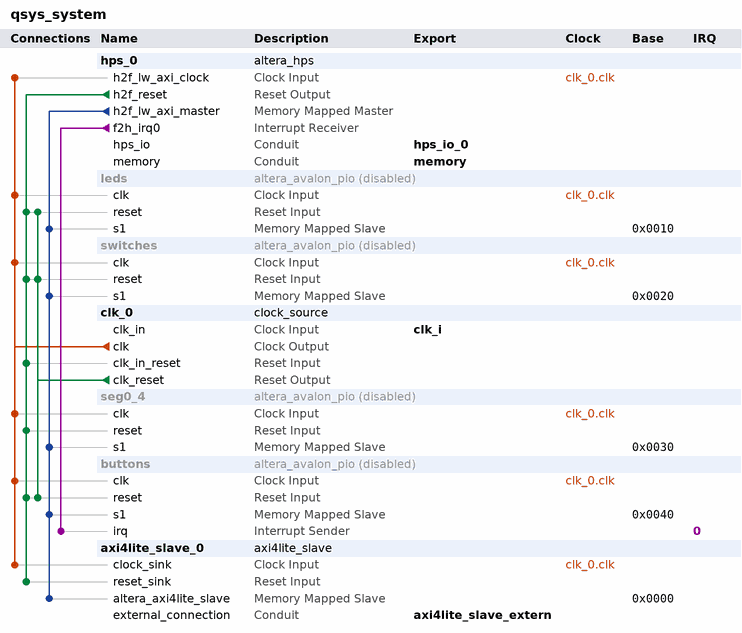
[diagram p0: system contents]
# Platform Designer (Qsys) system qsys_system, Cyclone V 5CSEMA5F31C6
# Parameters at their usual value, and those the tool derives, are not listed.
package require -exact qsys 23.1
create_system qsys_system
set_project_property DEVICE_FAMILY {Cyclone V}
set_project_property DEVICE 5CSEMA5F31C6

add_instance hps_0 altera_hps 23.1
set_instance_parameter_value hps_0 EMAC1_Mode N/A
set_instance_parameter_value hps_0 EMAC1_PinMuxing Unused
set_instance_parameter_value hps_0 F2SCLK_COLDRST_Enable false
set_instance_parameter_value hps_0 F2SCLK_DBGRST_Enable false
set_instance_parameter_value hps_0 F2SCLK_WARMRST_Enable false
set_instance_parameter_value hps_0 F2SINTERRUPT_Enable true
set_instance_parameter_value hps_0 F2S_Width 0
set_instance_parameter_value hps_0 FPGA_PERIPHERAL_OUTPUT_CLOCK_FREQ_EMAC0_GTX_CLK 125
set_instance_parameter_value hps_0 FPGA_PERIPHERAL_OUTPUT_CLOCK_FREQ_EMAC0_MD_CLK 2.5
set_instance_parameter_value hps_0 FPGA_PERIPHERAL_OUTPUT_CLOCK_FREQ_EMAC1_GTX_CLK 125
set_instance_parameter_value hps_0 FPGA_PERIPHERAL_OUTPUT_CLOCK_FREQ_EMAC1_MD_CLK 2.5
set_instance_parameter_value hps_0 HPS_PROTOCOL DDR3
set_instance_parameter_value hps_0 I2C0_Mode N/A
set_instance_parameter_value hps_0 I2C0_PinMuxing Unused
set_instance_parameter_value hps_0 I2C1_Mode N/A
set_instance_parameter_value hps_0 I2C1_PinMuxing Unused
set_instance_parameter_value hps_0 LWH2F_Enable true
set_instance_parameter_value hps_0 MEM_BANKADDR_WIDTH 3
set_instance_parameter_value hps_0 MEM_CLK_FREQ 400.0
set_instance_parameter_value hps_0 MEM_CLK_FREQ_MAX 400.0
set_instance_parameter_value hps_0 MEM_COL_ADDR_WIDTH 10
set_instance_parameter_value hps_0 MEM_DQ_WIDTH 32
set_instance_parameter_value hps_0 MEM_DRV_STR RZQ/7
set_instance_parameter_value hps_0 MEM_ROW_ADDR_WIDTH 15
set_instance_parameter_value hps_0 MEM_RTT_NOM RZQ/4
set_instance_parameter_value hps_0 MEM_RTT_WR RZQ/4
set_instance_parameter_value hps_0 MEM_TCL 11
set_instance_parameter_value hps_0 MEM_TFAW_NS 30.0
set_instance_parameter_value hps_0 MEM_TRAS_NS 35.0
set_instance_parameter_value hps_0 MEM_TRCD_NS 13.75
set_instance_parameter_value hps_0 MEM_TRFC_NS 260.0
set_instance_parameter_value hps_0 MEM_TRP_NS 13.75
set_instance_parameter_value hps_0 MEM_VENDOR JEDEC
set_instance_parameter_value hps_0 MEM_WTCL 8
set_instance_parameter_value hps_0 QSPI_Mode N/A
set_instance_parameter_value hps_0 QSPI_PinMuxing Unused
set_instance_parameter_value hps_0 REF_CLK_FREQ 25.0
set_instance_parameter_value hps_0 S2FCLK_USER2CLK 5
set_instance_parameter_value hps_0 S2F_Width 0
set_instance_parameter_value hps_0 SDIO_Mode N/A
set_instance_parameter_value hps_0 SDIO_PinMuxing Unused
set_instance_parameter_value hps_0 SPIM1_Mode N/A
set_instance_parameter_value hps_0 SPIM1_PinMuxing Unused
set_instance_parameter_value hps_0 STM_Enable false
set_instance_parameter_value hps_0 TIMING_BOARD_AC_SKEW 0.03
set_instance_parameter_value hps_0 TIMING_BOARD_AC_TO_CK_SKEW 0.0
set_instance_parameter_value hps_0 TIMING_BOARD_DQ_TO_DQS_SKEW 0.0
set_instance_parameter_value hps_0 TIMING_BOARD_MAX_CK_DELAY 0.03
set_instance_parameter_value hps_0 TIMING_BOARD_MAX_DQS_DELAY 0.02
set_instance_parameter_value hps_0 TIMING_BOARD_SKEW_BETWEEN_DQS 0.08
set_instance_parameter_value hps_0 TIMING_BOARD_SKEW_CKDQS_DIMM_MAX 0.16
set_instance_parameter_value hps_0 TIMING_BOARD_SKEW_CKDQS_DIMM_MIN 0.09
set_instance_parameter_value hps_0 TIMING_BOARD_SKEW_WITHIN_DQS 0.01
set_instance_parameter_value hps_0 TIMING_TDH 65
set_instance_parameter_value hps_0 TIMING_TDQSCK 255
set_instance_parameter_value hps_0 TIMING_TDQSQ 125
set_instance_parameter_value hps_0 TIMING_TDS 30
set_instance_parameter_value hps_0 TIMING_TIH 140
set_instance_parameter_value hps_0 TIMING_TIS 180
set_instance_parameter_value hps_0 TIMING_TQSH 0.4
set_instance_parameter_value hps_0 UART0_Mode N/A
set_instance_parameter_value hps_0 UART0_PinMuxing Unused
set_instance_parameter_value hps_0 USB1_Mode N/A
set_instance_parameter_value hps_0 USB1_PinMuxing Unused
set_instance_parameter_value hps_0 desired_cfg_clk_mhz 100.0
set_instance_parameter_value hps_0 desired_qspi_clk_mhz 400.0

add_instance leds altera_avalon_pio 23.1
set_instance_property leds ENABLED false
set_instance_parameter_value leds direction Output
set_instance_parameter_value leds width 10

add_instance switches altera_avalon_pio 23.1
set_instance_property switches ENABLED false
set_instance_parameter_value switches direction Input
set_instance_parameter_value switches width 10

add_instance clk_0 clock_source 23.1
set_instance_parameter_value clk_0 clockFrequency 50000000

add_instance seg0_4 altera_avalon_pio 23.1
set_instance_property seg0_4 ENABLED false
set_instance_parameter_value seg0_4 direction Output
set_instance_parameter_value seg0_4 width 28

add_instance buttons altera_avalon_pio 23.1
set_instance_property buttons ENABLED false
set_instance_parameter_value buttons captureEdge true
set_instance_parameter_value buttons direction Input
set_instance_parameter_value buttons generateIRQ true
set_instance_parameter_value buttons irqType EDGE
set_instance_parameter_value buttons width 4

add_instance axi4lite_slave_0 axi4lite_slave 1.0
set_instance_parameter_value axi4lite_slave_0 AXI_ADDR_WIDTH 12
set_instance_parameter_value axi4lite_slave_0 AXI_DATA_WIDTH 32

# connections
add_connection clk_0.clk axi4lite_slave_0.clock_sink clock
add_connection clk_0.clk buttons.clk clock
add_connection clk_0.clk hps_0.h2f_lw_axi_clock clock
add_connection clk_0.clk leds.clk clock
add_connection clk_0.clk seg0_4.clk clock
add_connection clk_0.clk switches.clk clock
add_connection clk_0.clk_reset buttons.reset reset
add_connection clk_0.clk_reset leds.reset reset
add_connection clk_0.clk_reset switches.reset reset
add_connection hps_0.h2f_reset axi4lite_slave_0.reset_sink reset
add_connection hps_0.h2f_reset buttons.reset reset
add_connection hps_0.h2f_reset clk_0.clk_in_reset reset
add_connection hps_0.h2f_reset leds.reset reset
add_connection hps_0.h2f_reset seg0_4.reset reset
add_connection hps_0.h2f_reset switches.reset reset
add_connection hps_0.h2f_lw_axi_master axi4lite_slave_0.altera_axi4lite_slave avalon
set_connection_parameter_value hps_0.h2f_lw_axi_master/axi4lite_slave_0.altera_axi4lite_slave baseAddress 0x0000
add_connection hps_0.h2f_lw_axi_master buttons.s1 avalon
set_connection_parameter_value hps_0.h2f_lw_axi_master/buttons.s1 baseAddress 0x0040
add_connection hps_0.h2f_lw_axi_master leds.s1 avalon
set_connection_parameter_value hps_0.h2f_lw_axi_master/leds.s1 baseAddress 0x0010
add_connection hps_0.h2f_lw_axi_master seg0_4.s1 avalon
set_connection_parameter_value hps_0.h2f_lw_axi_master/seg0_4.s1 baseAddress 0x0030
add_connection hps_0.h2f_lw_axi_master switches.s1 avalon
set_connection_parameter_value hps_0.h2f_lw_axi_master/switches.s1 baseAddress 0x0020
add_connection hps_0.f2h_irq0 buttons.irq interrupt
set_connection_parameter_value hps_0.f2h_irq0/buttons.irq irqNumber 0

# exported interfaces
add_interface axi4lite_slave_extern conduit end
set_interface_property axi4lite_slave_extern EXPORT_OF axi4lite_slave_0.external_connection
add_interface clk_i clock sink
set_interface_property clk_i EXPORT_OF clk_0.clk_in
add_interface hps_io_0 conduit end
set_interface_property hps_io_0 EXPORT_OF hps_0.hps_io
add_interface memory conduit end
set_interface_property memory EXPORT_OF hps_0.memory

set_interconnect_requirement {$system} qsys_mm.clockCrossingAdapter HANDSHAKE
set_interconnect_requirement {$system} qsys_mm.enableEccProtection FALSE
set_interconnect_requirement {$system} qsys_mm.insertDefaultSlave FALSE
set_interconnect_requirement {$system} qsys_mm.maxAdditionalLatency 1

save_system qsys_system.qsys
